# Altium schematic sheet 06_POWER_4.SchDoc
size 420 x 297 mm; SheetNumber: 10; SheetTotal: 33
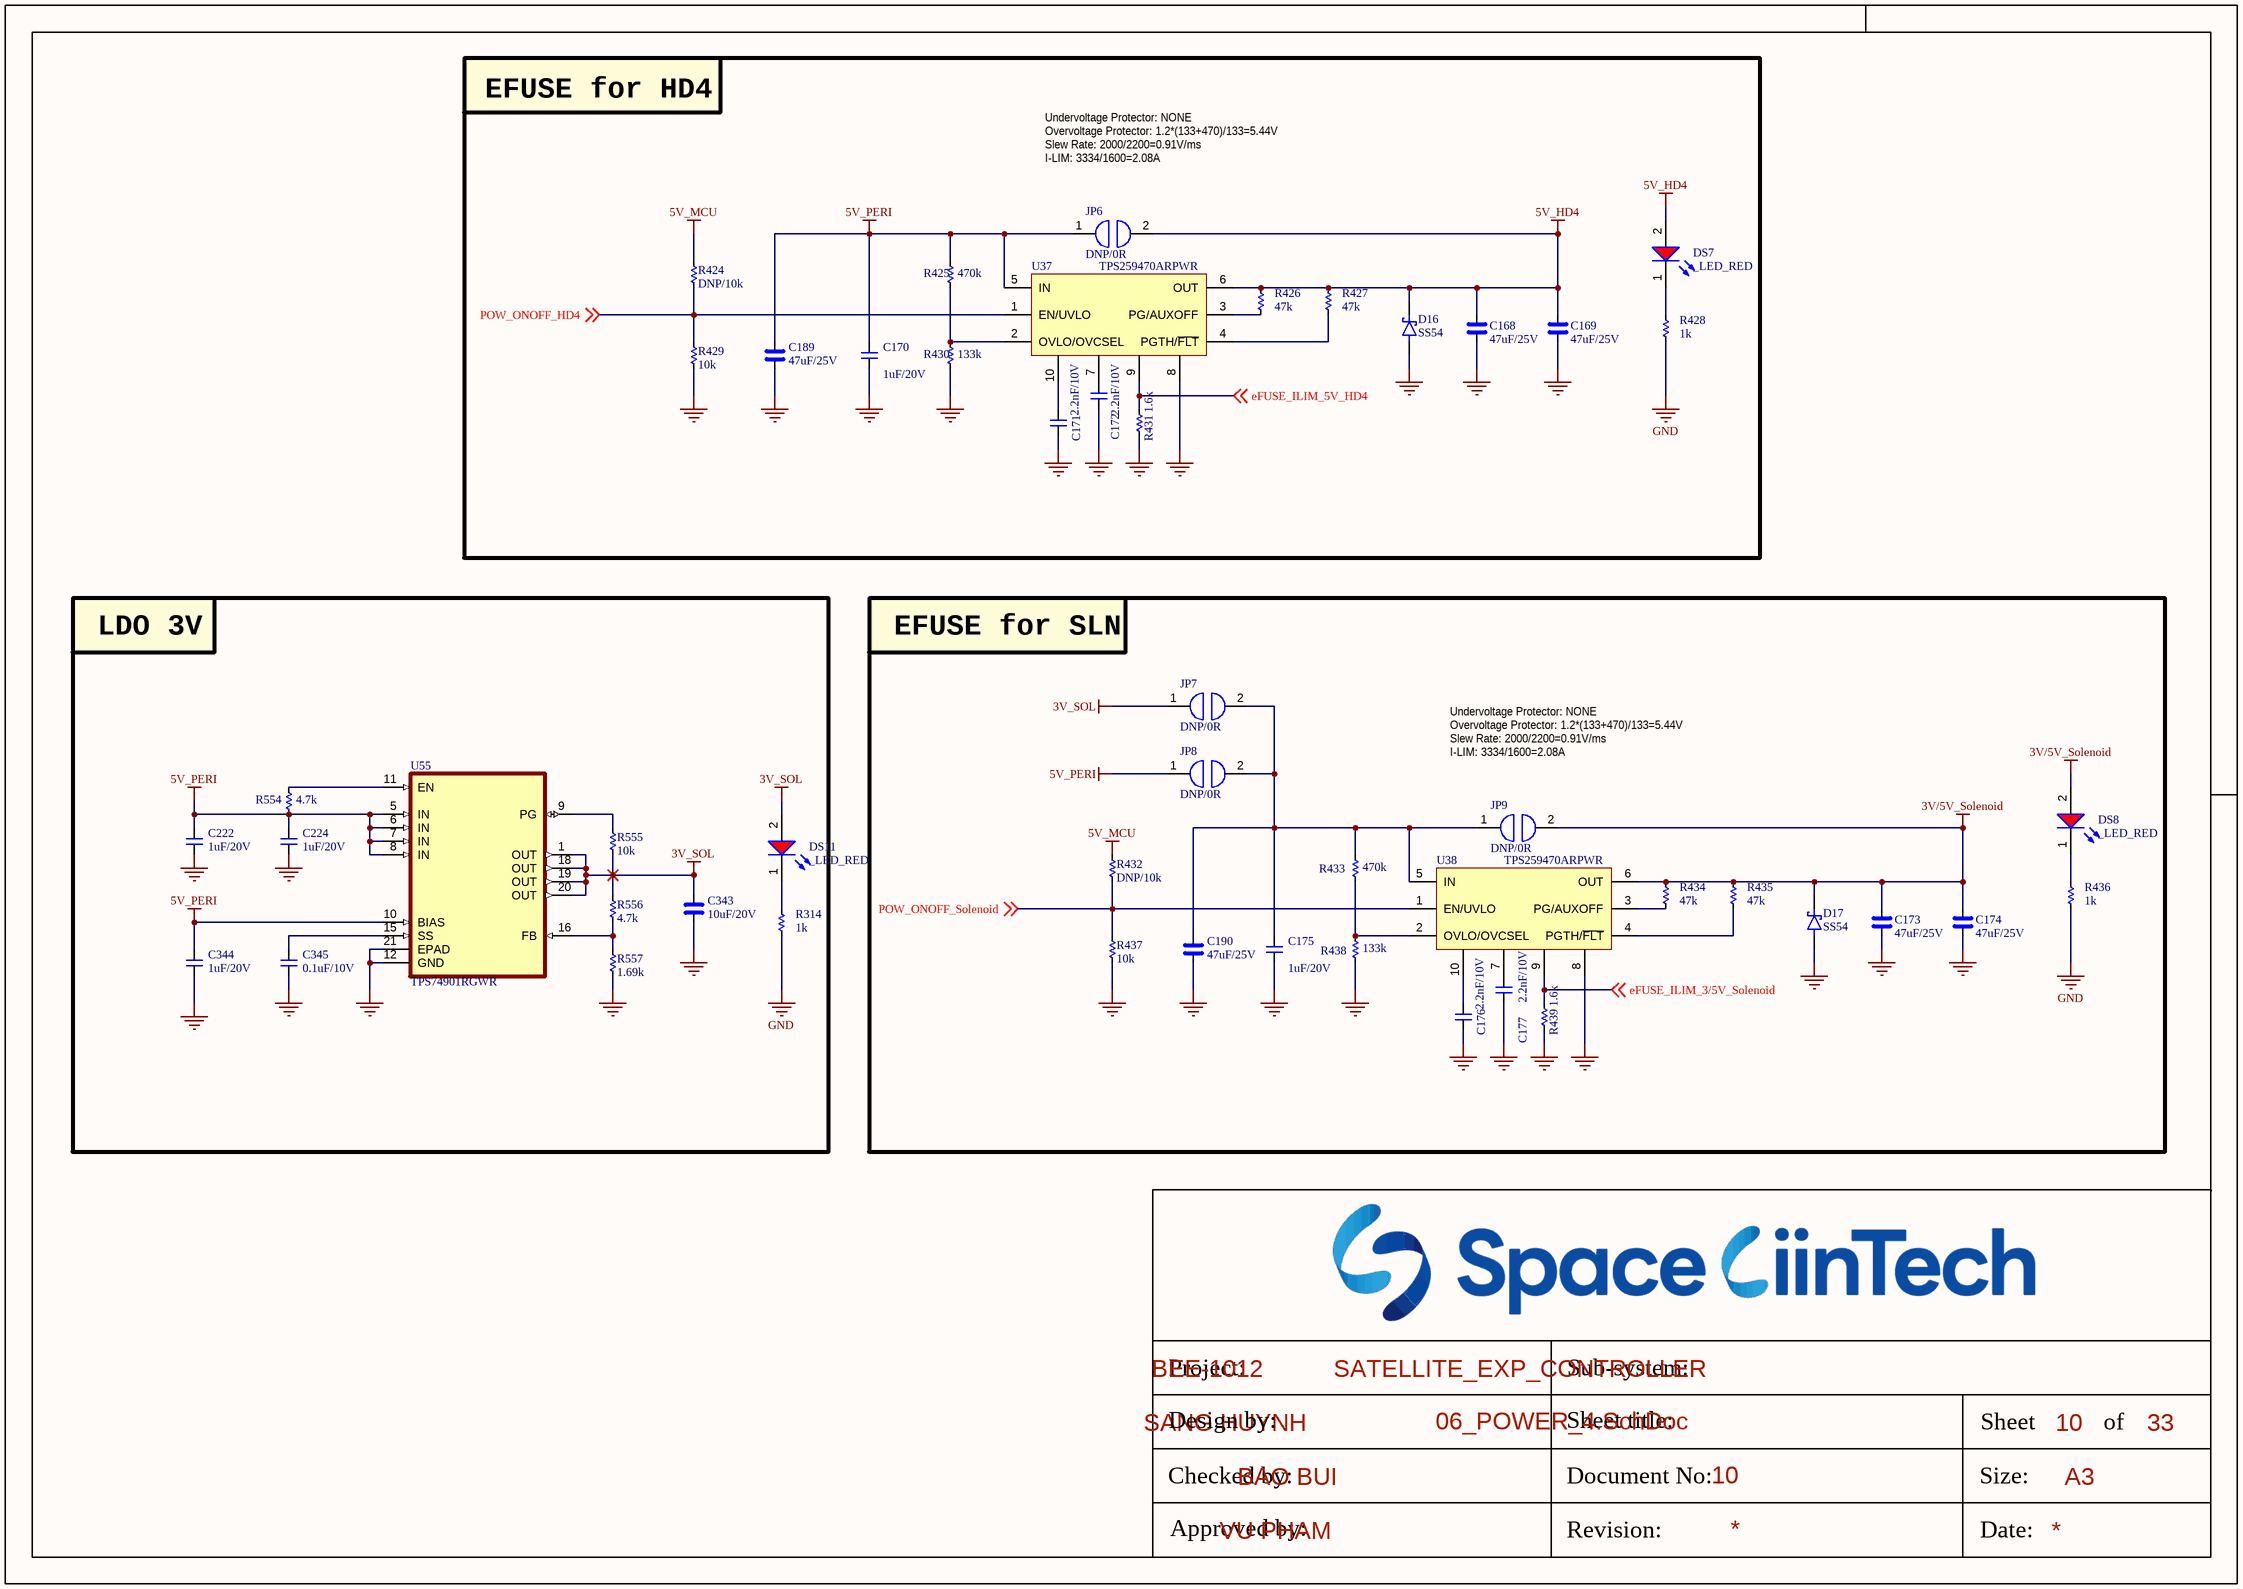
[diagram p0: 06_POWER_4.SchDoc]

## Parts
C168  47uF/25V  [CAP_C_3225X80]
C169  47uF/25V  [CAP_C_3225X80]
C170  1uF/20V  [CAP_C_1005X50_L]
C171  2.2nF/10V  [CAP_C_1005X50_L]
C172  2.2nF/10V  [CAP_C_1005X50_L]
C173  47uF/25V  [CAP_C_3225X80]
C174  47uF/25V  [CAP_C_3225X80]
C175  1uF/20V  [CAP_C_1005X50_L]
C176  2.2nF/10V  [CAP_C_1005X50_L]
C177  2.2nF/10V  [CAP_C_1005X50_L]
C189  47uF/25V  [CAP_C_3225X80]
C190  47uF/25V  [CAP_C_3225X80]
C222  1uF/20V  [CAP_C_1005X50_L]
C224  1uF/20V  [CAP_C_1005X50_L]
C343  10uF/20V  [CAP_C_2012X110]
C344  1uF/20V  [CAP_C_1005X50_L]
C345  0.1uF/10V  [CAP_C_1005X50_L]
D16  SS54  [DO-214AC_SMA]
D17  SS54  [DO-214AC_SMA]
DS7  _LED_RED  [LED_0402]
DS8  _LED_RED  [LED_0402]
DS11  _LED_RED  [LED_0402]
JP6  DNP/0R  [JUMPER_1608]
JP7  DNP/0R  [JUMPER_1608]
JP8  DNP/0R  [JUMPER_1608]
JP9  DNP/0R  [JUMPER_1608]
R314  1k  [RES_C_1005x30_L]
R424  DNP/10k  [RES_C_1005x30_L]
R425  470k  [RES_C_1005x30_L]
R426  47k  [RES_C_1005x30_L]
R427  47k  [RES_C_1005x30_L]
R428  1k  [RES_C_1005x30_L]
R429  10k  [RES_C_1005x30_L]
R430  133k  [RES_C_1005x30_L]
R431  1.6k  [RES_C_1005x30_L]
R432  DNP/10k  [RES_C_1005x30_L]
R433  470k  [RES_C_1005x30_L]
R434  47k  [RES_C_1005x30_L]
R435  47k  [RES_C_1005x30_L]
R436  1k  [RES_C_1005x30_L]
R437  10k  [RES_C_1005x30_L]
R438  133k  [RES_C_1005x30_L]
R439  1.6k  [RES_C_1005x30_L]
R554  4.7k  [RES_C_1005x30_L]
R555  10k  [RES_C_1005x30_L]
R556  4.7k  [RES_C_1005x30_L]
R557  1.69k  [RES_C_1005x30_L]
U37  TPS259470ARPWR  [VQFN-HR-10]
U38  TPS259470ARPWR  [VQFN-HR-10]
U55  TPS74901RGWR  [QFN65P500X500X100-21N]

## Blocks framed on the sheet
EFUSE for HD4: C168-C172 C189 D16 DS7 JP6 R424-R431 U37
LDO 3V: C222 C224 C343-C345 DS11 R314 R554-R557 U55
EFUSE for SLN: C173-C177 C190 D17 DS8 JP7-JP9 R432-R439 U38

## Nets
3V/5V_Solenoid: C173.2 C174.2 D17.1(K) DS8.2(A) JP9.2 R434.2 R435.2 U38.6(OUT)
3V_SOL: C343.1 DS11.2(A) JP7.1 R555.2 R556.1 U55.1(OUT) U55.18(OUT) U55.19(OUT) U55.20(OUT)
5V_HD4: C168.2 C169.2 D16.1(K) DS7.2(A) JP6.2 R426.2 R427.2 U37.6(OUT)
5V_MCU: R424.1 R432.1
5V_PERI: C170.2 C189.2 C222.2 C224.2 C344.2 JP6.1 JP8.1 R425.2 R554.2 U37.5(IN) U55.5(IN) U55.6(IN) U55.7(IN) U55.8(IN) U55.10(BIAS)
GND: C168.1 C169.1 C170.1 C171.1 C172.1 C173.1 C174.1 C175.1 C176.1 C177.1 C189.1 C190.1 C222.1 C224.1 C343.2 C344.1 C345.1 D16.2(A) D17.2(A) R314.1 R428.1 R429.2 R430.1 R431.1 R436.1 R437.2 R438.1 R439.1 R557.2 U37.8 U38.8 U55.12(GND) U55.21(EPAD)
eFUSE_ILIM_3/5V_Solenoid: R439.2 U38.9 ; off-sheet eFUSE_ILIM_3/5V_Solenoid
eFUSE_ILIM_5V_HD4: R431.2 U37.9 ; off-sheet eFUSE_ILIM_5V_HD4
POW_ONOFF_HD4: R424.2 R429.1 U37.1(EN/UVLO) ; off-sheet POW_ONOFF_HD4
POW_ONOFF_Solenoid: R432.2 R437.1 U38.1(EN/UVLO) ; off-sheet POW_ONOFF_Solenoid
NetC171_2: C171.2 U37.10
NetC172_2: C172.2 U37.7
NetC175_2: C175.2 C190.2 JP7.2 JP8.2 JP9.1 R433.2 U38.5(IN)
NetC176_2: C176.2 U38.10
NetC177_2: C177.2 U38.7
NetC345_2: C345.2 U55.15(SS)
NetDS7_1: DS7.1(K) R428.2
NetDS8_1: DS8.1(K) R436.2
NetDS11_1: DS11.1(K) R314.2
NetR425_1: R425.1 R430.2 U37.2(OVLO/OVCSEL)
NetR426_1: R426.1 U37.3(PG/AUXOFF)
NetR427_1: R427.1 U37.4(PGTH/~{FLT})
NetR433_1: R433.1 R438.2 U38.2(OVLO/OVCSEL)
NetR434_1: R434.1 U38.3(PG/AUXOFF)
NetR435_1: R435.1 U38.4(PGTH/~{FLT})
NetR554_1: R554.1 U55.11(EN)
NetR555_1: R555.1 U55.9(PG)
NetR556_2: R556.2 R557.1 U55.16(FB)

## Notes on the sheet
- Undervoltage Protector: NONE
- Overvoltage Protector: 1.2*(133+470)/133=5.44V
- Slew Rate: 2000/2200=0.91V/ms
- I-LIM: 3334/1600=2.08A
- Project:
- BEE-1012
- Sub-system:
- SATELLITE_EXP_CONTROLLER
- Design by:
- SANG HUYNH
- BAO BUI
- Sheet title:
- Sheet
- A3
- of
- Checked by:
- Approved by:
- VU PHAM
- Revision:
- Document No:
- Size:
- Date:

## Library data of the parts
C168 C169 C173 C174 C189 C190 C343 = _CAP_C_High_2: CAP High Value
C170-C172 C175-C177 C222 C224 C344 C345 = _CAP_C_2: CAP
D16 D17 = DIODE SCHOTTKY
JP6-JP9 = JUMPER
R314 R424-R439 R554-R557 = _RES_B_2: RES
U55 = IC_PWR_TPS74901RGWR: 3-A, low-VIN (0.8-V), adjustable ultra-low-dropout voltage regulator with power good & enable 20-VQFN -40 to 125; MF: Texas Instruments; Price: None; Check_prices: https://www.snapeda.com/parts/TPS74901RGWR/Texas%20Instruments/view-part/1101342/?ref=eda; SnapEDA_Link: https://www.snapeda.com/parts/TPS74901RGWR/Texas%20Instruments/view-part/1101342/?ref=snap; Package: VQFN-20 Texas Instruments; Purchase-URL: https://pricing.snapeda.com/search/part/TPS74901RGWR/?ref=eda; Availability: Good; MP: TPS74901RGWR; Value: *